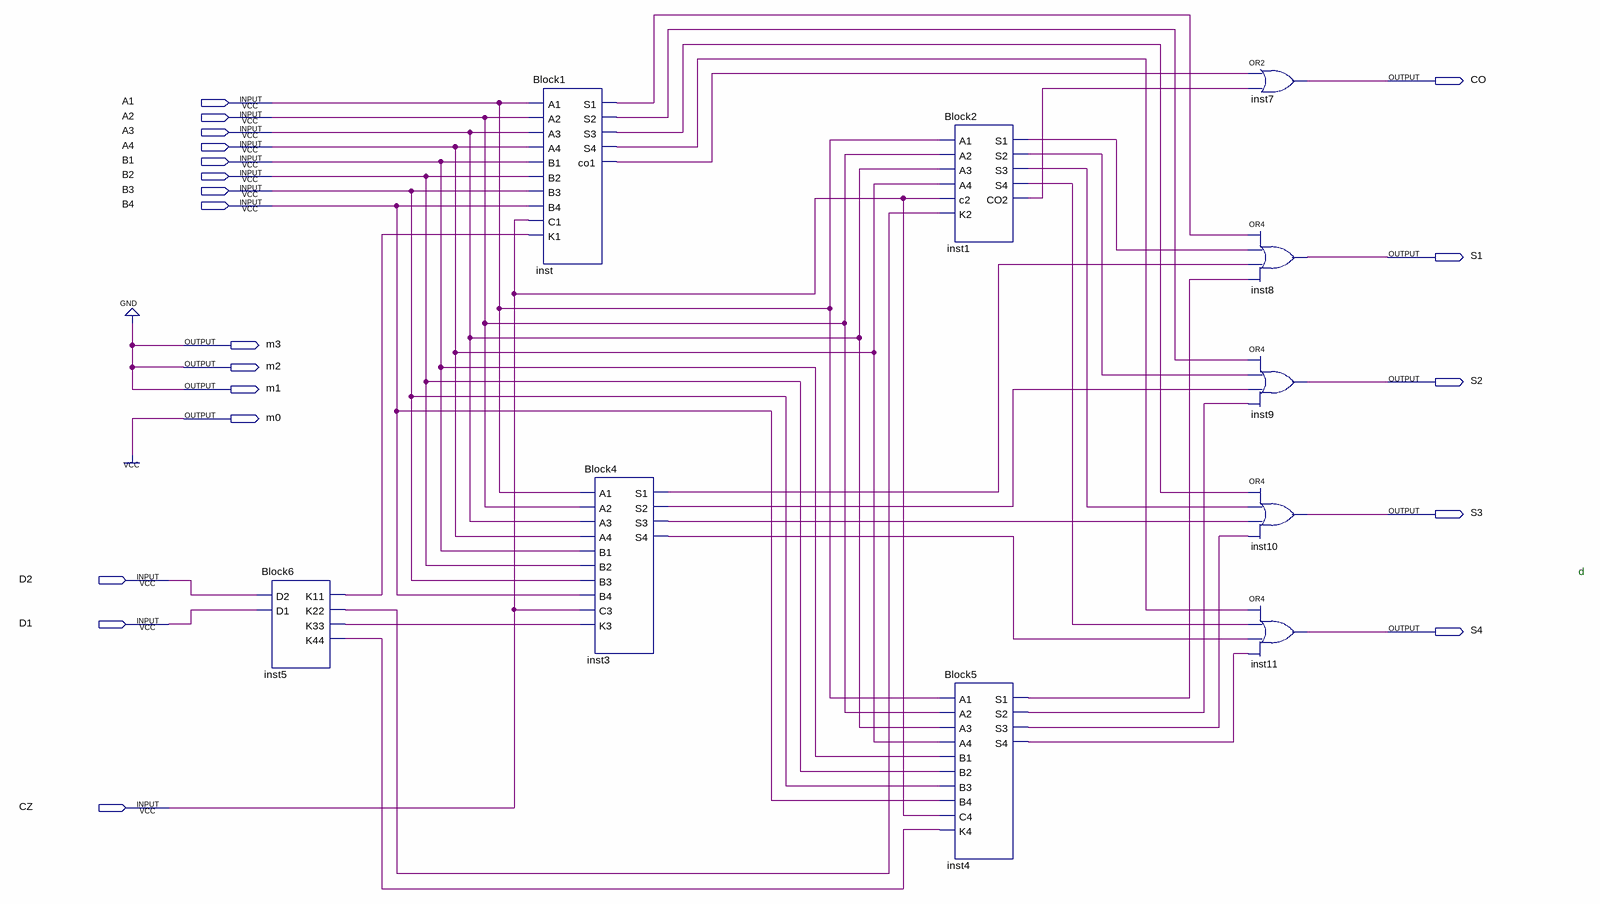
[diagram p0: schematic sheet]
// Quartus schematic ALU.bdf as structural Verilog: 10 symbols, 20 pins
module ALU (
  input  A1,
  input  A2,
  input  A3,
  input  A4,
  input  B1,
  input  B2,
  input  B3,
  input  B4,
  input  D2,
  input  D1,
  input  CZ,
  output CO,
  output S1,
  output m3,
  output m2,
  output S2,
  output m1,
  output m0,
  output S3,
  output S4
);

  wire inst1_co2, inst1_s1, inst1_s2, inst1_s3, inst1_s4, inst3_s1, inst3_s2, inst3_s3, inst3_s4, inst4_s1,
       inst4_s2, inst4_s3, inst4_s4, inst5_k11, inst5_k22, inst5_k33, inst5_k44, inst_co1, inst_s1, inst_s2,
       inst_s3, inst_s4;

  Block6 inst5 (.D2(D2), .D1(D1), .K11(inst5_k11), .K22(inst5_k22), .K33(inst5_k33), .K44(inst5_k44));
  Block1 inst (
    .A1(A1), .A2(A2), .A3(A3), .A4(A4), .B1(B1), .B2(B2), .B3(B3), .B4(B4), .C1(CZ), .K1(inst5_k11),
    .S1(inst_s1), .S2(inst_s2), .S3(inst_s3), .S4(inst_s4), .co1(inst_co1));
  Block4 inst3 (
    .A1(A1), .A2(A2), .A3(A3), .A4(A4), .B1(B1), .B2(B2), .B3(B3), .B4(B4), .C3(CZ), .K3(inst5_k33),
    .S1(inst3_s1), .S2(inst3_s2), .S3(inst3_s3), .S4(inst3_s4));
  Block2 inst1 (
    .A1(A1), .A2(A2), .A3(A3), .A4(A4), .c2(CZ), .K2(inst5_k22), .S1(inst1_s1), .S2(inst1_s2), .S3(inst1_s3),
    .S4(inst1_s4), .CO2(inst1_co2));
  Block5 inst4 (
    .A1(A1), .A2(A2), .A3(A3), .A4(A4), .B1(B1), .B2(B2), .B3(B3), .B4(B4), .C4(CZ), .K4(inst5_k44),
    .S1(inst4_s1), .S2(inst4_s2), .S3(inst4_s3), .S4(inst4_s4));
  or inst7 (CO, inst_co1, inst1_co2);
  or inst8 (S1, inst_s1, inst1_s1, inst3_s1, inst4_s1);
  or inst9 (S2, inst_s2, inst1_s2, inst3_s2, inst4_s2);
  or inst10 (S3, inst_s3, inst1_s3, inst3_s3, inst4_s3);
  or inst11 (S4, inst_s4, inst1_s4, inst3_s4, inst4_s4);

  assign m0 = 1'b1;
  assign m1 = 1'b0;
  assign m2 = 1'b0;
  assign m3 = 1'b0;

  // Notes on the sheet:
  //   d
endmodule
